# Altium schematic sheet PowerAndSystem.SchDoc
size 420 x 297 mm; Address1: Address1; Address2: Address2; Address3: Address3; Address4: Address4; DocumentNumber: АБВГ.123456.001 Э3; SheetNumber: 7; SheetTotal: 7; Scale: 1:1; DocumentType: Схема электрическая принципиальная; FirstReferrence: АБВГ.123456.001
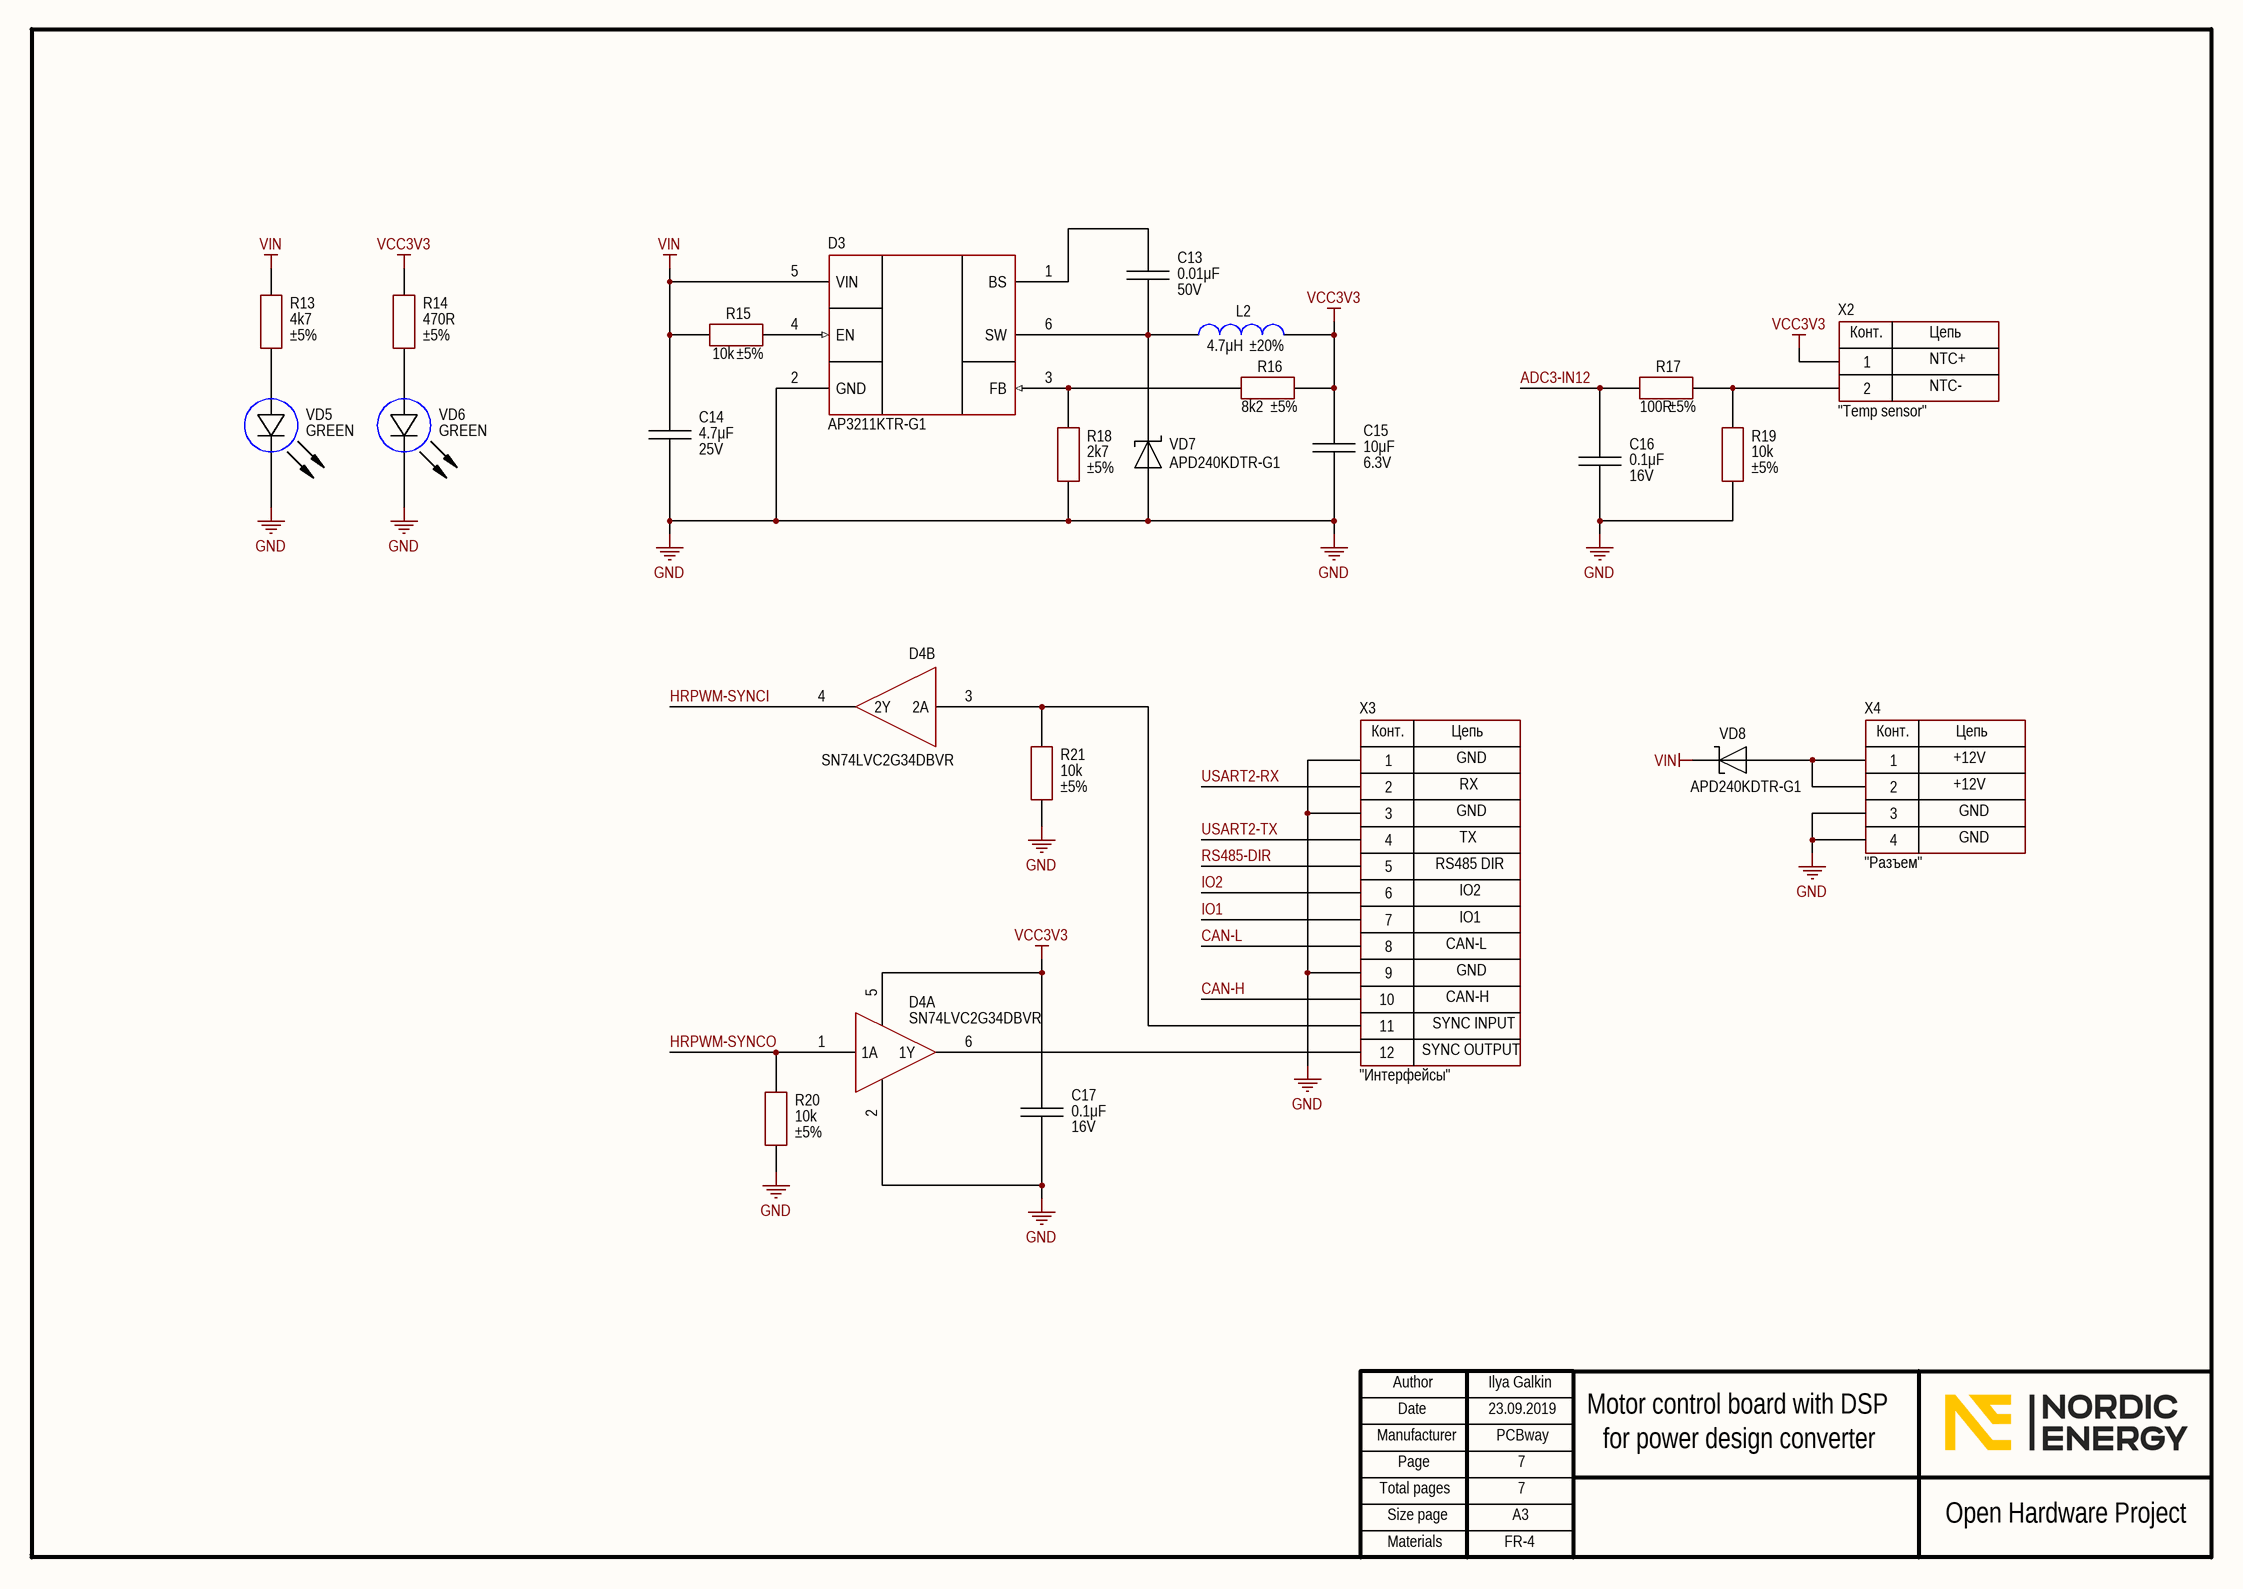
[diagram p0: PowerAndSystem.SchDoc]

## Parts
C13  value 0.01μF  Voltage: 50V  [CAP: 0805]
C14  value 4.7μF  Voltage: 25V  [CAP: 0805]
C15  value 10μF  Voltage: 6.3V  [CAP: 0805]
C16  value 0.1μF  Voltage: 16V  [CAP: 0805]
C17  value 0.1μF  Voltage: 16V  [CAP: 0805]
D3  (no value)  [SOT23-6]
D4  (no value)  [SOT23-6]  (parts A,B of 2)
L2  value 4.7μH  Tolerance: ±20%  [IND: SRP2510A]
R13  value 4k7  Tolerance: ±5%  [RES: 0805]
R14  value 470R  Tolerance: ±5%  [RES: 0805]
R15  value 10k  Tolerance: ±5%  [RES: 0805]
R16  value 8k2  Tolerance: ±5%  [RES: 0805]
R17  value 100R  Tolerance: ±5%  [RES: 0805]
R18  value 2k7  Tolerance: ±5%  [RES: 0805]
R19  value 10k  Tolerance: ±5%  [RES: 0805]
R20  value 10k  Tolerance: ±5%  [RES: 0805]
R21  value 10k  Tolerance: ±5%  [RES: 0805]
VD5  Color: GREEN  [LED: 0805G]
VD6  Color: GREEN  [LED: 0805G]
VD7  PartNumber: APD240KDTR-G1  [DIODE: SOD123]
VD8  PartNumber: APD240KDTR-G1  [DIODE: SOD123]
X2  CommentText: "Temp sensor"  [CON: PLS-2]
X3  CommentText: "Интерфейсы"  [CON: PLD-12]
X4  CommentText: "Разъем"  [CON: PLD-4]

## Nets
GND: C14.1 C15.1 C16.1 C17.1 D3.2(GND) D4.2 R18.1 R19.1 R20.2 R21.2 VD5.2(C) VD6.2(C) VD7.1 X3.1 X3.3 X3.9 X4.3 X4.4
VCC3V3: C15.2 C17.2 D4.5 L2.1 R14.2 R16.2 X2.1
VIN: C14.2 D3.5(VIN) R13.1 R15.1 VD8.2
ADC3-IN12: C16.2 R17.1
CAN-H: X3.10
CAN-L: X3.8
HRPWM-SYNCI: D4.4(2Y)
HRPWM-SYNCO: D4.1(1A) R20.1
IO1: X3.7
IO2: X3.6
RS485-DIR: X3.5
USART2-RX: X3.2
USART2-TX: X3.4
NetC13_1: C13.1 D3.6(SW) L2.2 VD7.2
NetC13_2: C13.2 D3.1(BS)
NetD3_3: D3.3(FB) R16.1 R18.2
NetD3_4: D3.4(EN) R15.2
NetD4_3: D4.3(2A) R21.1 X3.11
NetD4_6: D4.6(1Y) X3.12
NetR13_2: R13.2 VD5.1(A)
NetR14_1: R14.1 VD6.1(A)
NetR17_2: R17.2 R19.2 X2.2
NetVD8_1: VD8.1 X4.1 X4.2

## Notes on the sheet
- NTC+
- NTC-
- GND
- RX
- +12V
- RS485 DIR
- TX
- IO1
- IO2
- CAN-L
- CAN-H
- SYNC OUTPUT
- SYNC INPUT
- Ilya Galkin
- 23.09.2019
- PCBway
- 7
- Motor control board with DSP
- for power design converter
- FR-4
- Author
- Manufacturer
- Date
- Page
- Total pages
- Size page
- A3
- Open Hardware Project
- Materials
- (in symbol PLD-4) Конт.; Цепь
- (in symbol PLD-12) Конт.; Цепь
- (in symbol PLS-2) Конт.; Цепь

## Library data of the parts
C13 = Ceramic_0805: Manufacturer: Yageo; PartNumber: CC0805KRX7R9BB103; ValueManufacturerPartNumber: Ceramic capacitor, 0.01μF, X7R, ±10%, 50V, 0805, -55...+125°C; TypeCapacitor: Ceramic capacitor; Tolerance: ±10%; TypeDielectric: X7R; Package: 0805; HelpURL: https://www.digikey.com/product-detail/en/yageo/CC0805KRX7R9BB103/311-1136-1-ND/303046; Temperature: -55...+125°C
C14 = Ceramic_0805: Manufacturer: Samsung; PartNumber: CL21B475KAFNNNE; ValueManufacturerPartNumber: Ceramic capacitor, 4.7μF, X7R, ±10%, 25V, 0805, -55...+125°C; TypeCapacitor: Ceramic capacitor; Tolerance: ±10%; TypeDielectric: X7R; Package: 0805; HelpURL: https://www.digikey.com/product-detail/en/samsung-electro-mechanics/CL21B475KAFNNNE/1276-2969-1-ND/3891055; Temperature: -55...+125°C
C15 = Ceramic_0805: Manufacturer: Samsung; PartNumber: CL21B106KQQNNNE; ValueManufacturerPartNumber: Ceramic capacitor, 10μF, X7R, ±10%, 6.3V, 0805, -55...+125°C; TypeCapacitor: Ceramic capacitor; Tolerance: ±10%; TypeDielectric: X7R; Package: 0805; HelpURL: https://www.digikey.com/product-detail/en/samsung-electro-mechanics/CL21B106KQQNNNE/1276-1113-1-ND/3889199; Temperature: -55...+125°C
C16 C17 = Ceramic_0805: Manufacturer: Yageo; PartNumber: CC0805KRX7R7BB104; ValueManufacturerPartNumber: Ceramic capacitor, 0.1μF, X7R, ±10%, 16V, 0805, -55...+125°C; TypeCapacitor: Ceramic capacitor; Tolerance: ±10%; TypeDielectric: X7R; Package: 0805; HelpURL: https://www.digikey.com/product-detail/en/yageo/CC0805KRX7R7BB104/311-1142-1-ND/303052; Temperature: -55...+125°C
D3 = AP3211KTR-G1: Buck converter; Manufacturer: Diodes Incorporated; ValueManufacturerPartNumber: DC/DC buck converter, input 4.5...18V, 1.4MHz, output 0.81...15V, 1.5A, -40...+85°C, SOT23-6; VoltageInput: input 4.5...18V; Frequency: 1.4MHz; CurrentOutput: 1.5A; VoltageOutput: output 0.81...15V; HelpURL: https://www.digikey.com/product-detail/en/diodes-incorporated/AP3211KTR-G1/AP3211KTR-G1DICT-ND/4505305; Package: SOT23-6; ComponentType: DC/DC buck converter; Temperature: -40...+85°C; PartNumber: AP3211KTR-G1
D4 = SN74LVC2G34DBVR: Buffer; Manufacturer: Texas Instruments; ValueManufacturerPartNumber: IC logic buffer, 1.65...5.5V, -40...+125°C, SOT23-6; Supply: 1.65...5.5V; HelpURL: https://www.digikey.com/product-detail/en/texas-instruments/SN74LVC2G34DBVR/296-13496-1-ND/486431; Package: SOT23-6; ComponentType: IC logic buffer; Temperature: -40...+125°C; PartNumber: SN74LVC2G34DBVR
L2 = Inductor_SRP2510A: Manufacturer: Bourns; PartNumber: SRP2510A-4R7M; ValueManufacturerPartNumber: Fixed inductor, 4.7μH, ±20%, SRP2510A, 1.36A, -40...+125°C; TypeInductor: Fixed inductor; MaxCurrent: 1.36A; Package: SRP2510A; HelpURL: https://www.digikey.com/product-detail/en/bourns-inc/SRP2510A-4R7M/SRP2510A-4R7MCT-ND/7354840; Temperature: -40...+125°C
R13 = Resistor_0805: Manufacturer: Yageo; PartNumber: RC0805JR-074K7L; ValueManufacturerPartNumber: Resistor film, 4k7, ±5%, 0805, 0.125W, -55...+125°C; TypeResistor: Resistor film; Power: 0.125W; Package: 0805; HelpURL: https://www.digikey.com/product-detail/en/yageo/RC0805JR-074K7L/311-4.7KARCT-ND/731274; Temperature: -55...+125°C
R14 = Resistor_0805: Manufacturer: Yageo; PartNumber: RC0805JR-07470RL; ValueManufacturerPartNumber: Resistor film, 470R, ±5%, 0805, 0.125W, -55...+125°C; TypeResistor: Resistor film; Power: 0.125W; Package: 0805; HelpURL: https://www.digikey.com/product-detail/en/yageo/RC0805JR-07470RL/311-470ARCT-ND/731280; Temperature: -55...+125°C
R15 R19-R21 = Resistor_0805: Manufacturer: Yageo; PartNumber: RC0805JR-0710KL; ValueManufacturerPartNumber: Resistor film, 10k, ±5%, 0805, 0.125W, -55...+125°C; TypeResistor: Resistor film; Power: 0.125W; Package: 0805; HelpURL: https://www.digikey.com/product-detail/en/yageo/RC0805JR-0710KL/311-10KARCT-ND/731188; Temperature: -55...+125°C
R16 = Resistor_0805: Manufacturer: Yageo; PartNumber: RC0805JR-078K2L; ValueManufacturerPartNumber: Resistor film, 8k2, ±5%, 0805, 0.125W, -55...+125°C; TypeResistor: Resistor film; Power: 0.125W; Package: 0805; HelpURL: https://www.digikey.com/product-detail/en/yageo/RC0805JR-078K2L/311-8.2KARCT-ND/731320; Temperature: -55...+125°C
R17 = Resistor_0805: Manufacturer: Yageo; PartNumber: RC0805JR-07100RL; ValueManufacturerPartNumber: Resistor film, 100R, ±5%, 0805, 0.125W, -55...+125°C; TypeResistor: Resistor film; Power: 0.125W; Package: 0805; HelpURL: https://www.digikey.com/product-detail/en/yageo/RC0805JR-07100RL/311-100ARCT-ND/731185; Temperature: -55...+125°C
R18 = Resistor_0805: Manufacturer: Yageo; PartNumber: RC0805JR-072K7L; ValueManufacturerPartNumber: Resistor film, 2k7, ±5%, 0805, 0.125W, -55...+125°C; TypeResistor: Resistor film; Power: 0.125W; Package: 0805; HelpURL: https://www.digikey.com/product-detail/en/yageo/RC0805JR-072K7L/311-2.7KARCT-ND/731224; Temperature: -55...+125°C
VD5 VD6 = LED_single: Manufacturer: Wurth; ValueManufacturerPartNumber: LED, 20mA, 2V, 0805, -55...+150°C; PartNumber: 150080VS75000; TypeDiode: LED; Current: 20mA; VoltageDrop: 2V; Package: 0805; HelpURL: https://www.digikey.com/product-detail/en/wurth-electronics-inc/150080VS75000/732-4986-1-ND/4489922; Temperature: -55...+150°C
VD7 VD8 = Schottky_single: Manufacturer: Diodes Incorporated; ValueManufacturerPartNumber: Schottky diode, 40V, 2A, 500mV, 15pF, SOD-123, -55...+150°C; TypeDiode: Schottky diode; Voltage: 40V; Current: 2A; VoltageDrop: 500mV; RecoveryTime: 15pF; Package: SOD-123; HelpURL: https://www.digikey.com/product-detail/en/diodes-incorporated/APD240KDTR-G1/APD240KDTR-G1DICT-ND/7708824; Temperature: -55...+150°C
X2 = PLS-2: Manufacturer: Connfly; ValueManufacturerPartNumber: Connector, 2pin, 2.54mm, 500VAC, 3A; TypeConnector: Connector; VoltageMax: 500VAC; Pitch: 2.54mm; CurrentMax: 3A; Multichannel: 2pin; HelpURL: https://www.chipdip.ru/product/pls-2; PartNumber: PLS-2
X3 = PLD-12: Manufacturer: Connfly; ValueManufacturerPartNumber: Connector, 12pin, 2.54mm, 500VAC, 3A; TypeConnector: Connector; VoltageMax: 500VAC; Pitch: 2.54mm; CurrentMax: 3A; Multichannel: 12pin; HelpURL: https://www.chipdip.ru/product/pld-12; PartNumber: PLD-12
X4 = PLD-4: Manufacturer: Connfly; ValueManufacturerPartNumber: Connector, 6pin, 2.54mm, 500VAC, 3A; TypeConnector: Connector; VoltageMax: 500VAC; Pitch: 2.54mm; CurrentMax: 3A; Multichannel: 6pin; HelpURL: https://www.chipdip.ru/product/pld-6; PartNumber: PLD-4